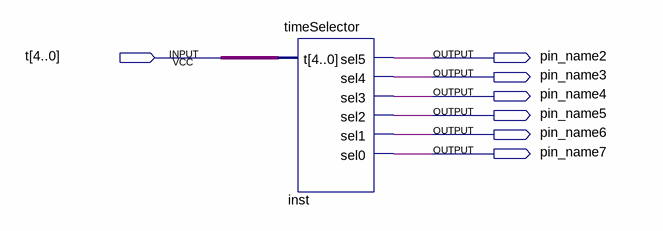
[diagram p0: schematic sheet]
// Quartus schematic testes.bdf as structural Verilog: 1 symbols, 7 pins
module testes (
  input  [4:0] t,
  output pin_name2,
  output pin_name3,
  output pin_name4,
  output pin_name5,
  output pin_name6,
  output pin_name7
);

  timeSelector inst (
    .t(t), .sel5(pin_name2), .sel4(pin_name3), .sel3(pin_name4), .sel2(pin_name5), .sel1(pin_name6),
    .sel0(pin_name7));
endmodule
